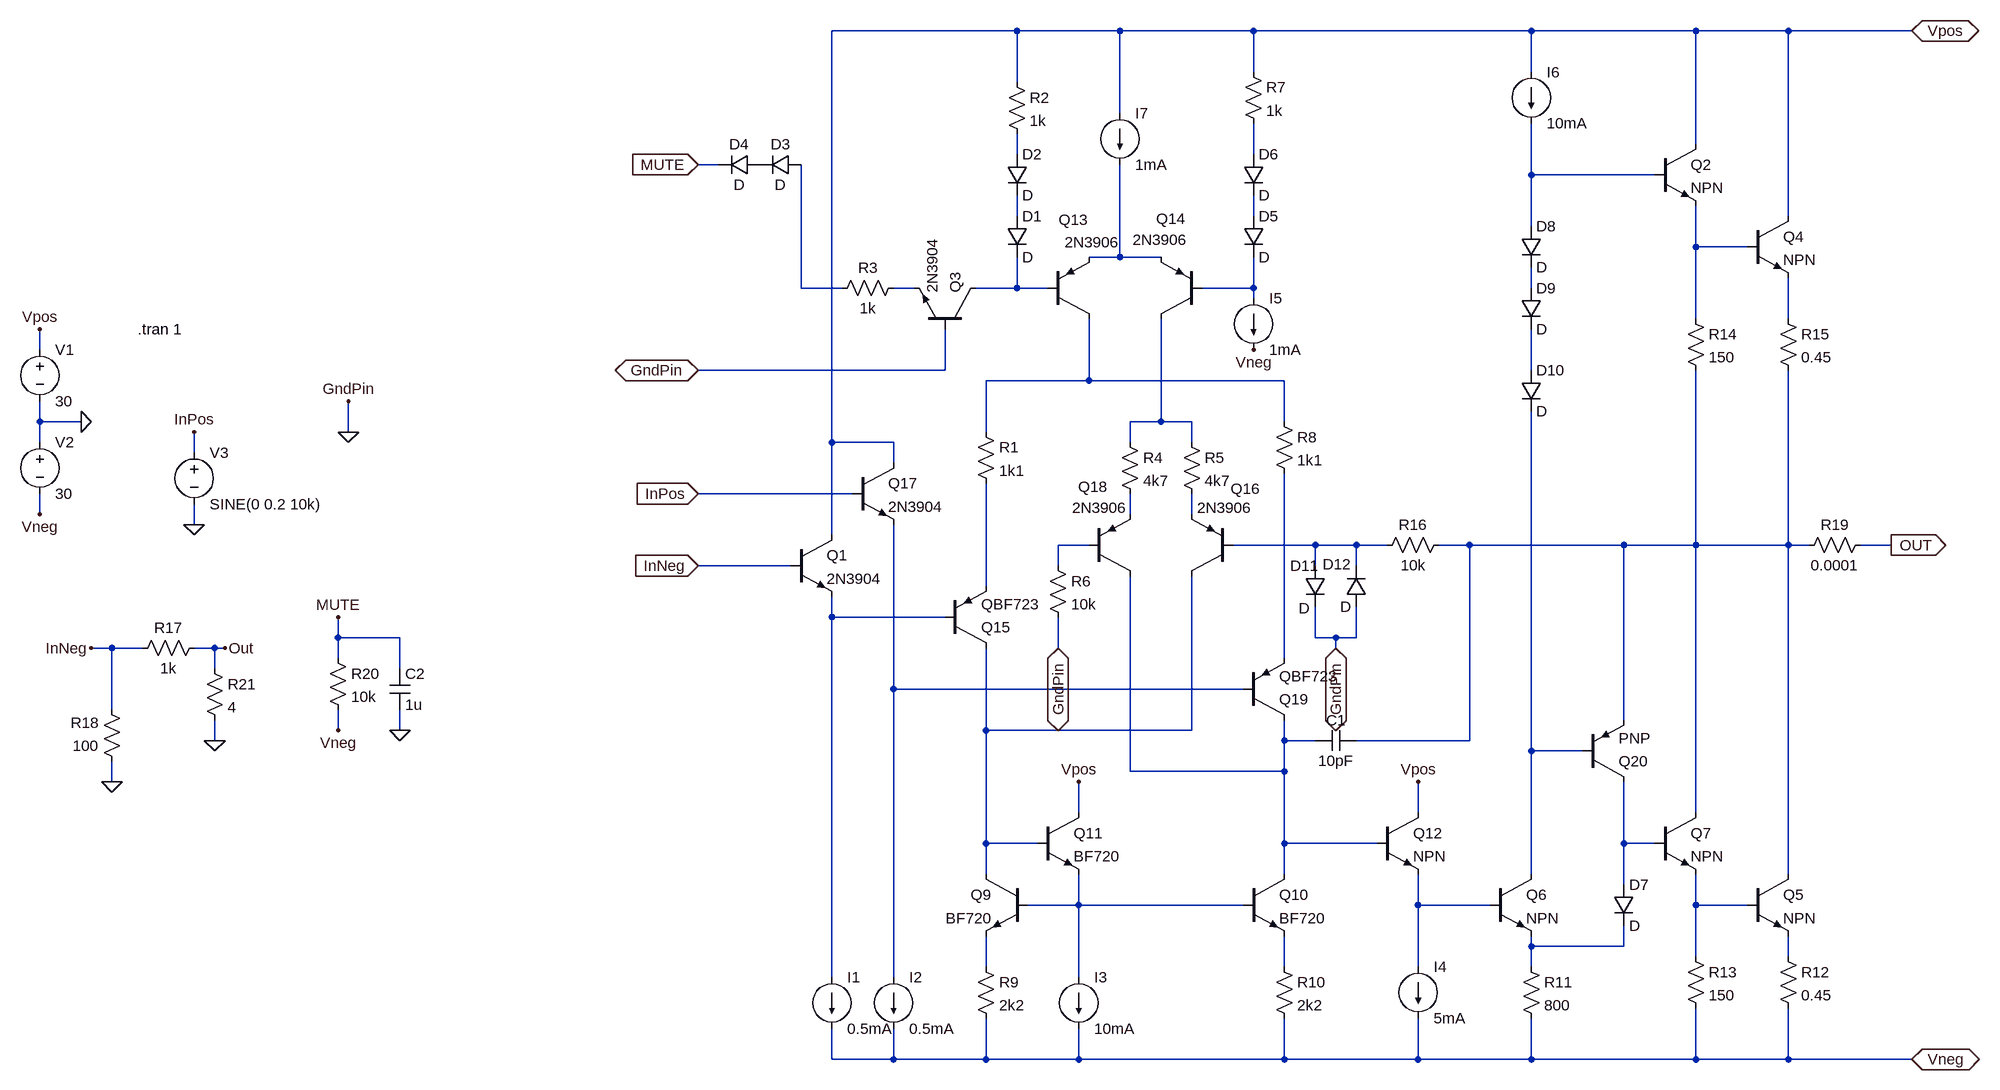
[diagram p0: schematic LM3886_MV2LT1363TRANSasc-1.asc]
LM3886_MV2LT1363TRANSasc-1.asc, the LTspice schematic file:
Version 4
SHEET 1 2284 1080
WIRE 144 -656 -144 -656
WIRE 304 -656 144 -656
WIRE 512 -656 304 -656
WIRE 944 -656 512 -656
WIRE 1200 -656 944 -656
WIRE 1344 -656 1200 -656
WIRE 1536 -656 1344 -656
WIRE 512 -592 512 -656
WIRE 944 -592 944 -656
WIRE 144 -576 144 -656
WIRE 304 -528 304 -656
WIRE 1200 -480 1200 -656
WIRE 144 -464 144 -496
WIRE 512 -464 512 -512
WIRE -320 -448 -352 -448
WIRE 944 -432 944 -512
WIRE 1136 -432 944 -432
WIRE 144 -368 144 -400
WIRE 512 -368 512 -400
WIRE 1344 -368 1344 -656
WIRE 944 -352 944 -432
WIRE 1200 -320 1200 -384
WIRE 1280 -320 1200 -320
WIRE 304 -304 304 -448
WIRE 304 -304 256 -304
WIRE 368 -304 304 -304
WIRE -192 -256 -192 -448
WIRE -128 -256 -192 -256
WIRE -16 -256 -48 -256
WIRE 144 -256 144 -304
WIRE 144 -256 80 -256
WIRE 192 -256 144 -256
WIRE 512 -256 512 -304
WIRE 512 -256 432 -256
WIRE 944 -256 944 -288
WIRE 512 -240 512 -256
WIRE 1200 -208 1200 -320
WIRE 1344 -208 1344 -272
WIRE -1376 -160 -1376 -192
WIRE 32 -128 32 -192
WIRE 32 -128 -352 -128
WIRE 944 -128 944 -192
WIRE 256 -112 256 -208
WIRE 256 -112 96 -112
WIRE 560 -112 256 -112
WIRE -1376 -48 -1376 -80
WIRE -1312 -48 -1376 -48
WIRE 368 -48 368 -208
WIRE 368 -48 320 -48
WIRE 416 -48 368 -48
WIRE 560 -48 560 -112
WIRE -896 -32 -896 -80
WIRE 96 -32 96 -112
WIRE -1376 -16 -1376 -48
WIRE -144 -16 -144 -656
WIRE -48 -16 -144 -16
WIRE 320 -16 320 -48
WIRE 416 -16 416 -48
WIRE -1136 0 -1136 -32
WIRE -48 16 -48 -16
WIRE -112 64 -352 64
WIRE -1376 96 -1376 64
WIRE 320 96 320 64
WIRE 416 96 416 64
WIRE -1136 112 -1136 80
WIRE -144 128 -144 -16
WIRE 256 144 208 144
WIRE 608 144 480 144
WIRE 672 144 608 144
WIRE 720 144 672 144
WIRE 848 144 800 144
WIRE 1088 144 848 144
WIRE 1200 144 1200 -128
WIRE 1200 144 1088 144
WIRE 1344 144 1344 -128
WIRE 1344 144 1200 144
WIRE 1376 144 1344 144
WIRE 1504 144 1456 144
WIRE -208 176 -352 176
WIRE 208 176 208 144
WIRE 608 176 608 144
WIRE 672 176 672 144
WIRE 96 208 96 48
WIRE -144 256 -144 224
WIRE 32 256 -144 256
WIRE -912 288 -912 256
WIRE -816 288 -912 288
WIRE 608 288 608 240
WIRE 640 288 608 288
WIRE 672 288 672 240
WIRE 672 288 640 288
WIRE -1264 304 -1296 304
WIRE -1216 304 -1264 304
WIRE -1104 304 -1136 304
WIRE -1088 304 -1104 304
WIRE 208 304 208 256
WIRE 640 304 640 288
WIRE -912 320 -912 288
WIRE 560 320 560 32
WIRE -1104 336 -1104 304
WIRE -816 336 -816 288
WIRE -48 368 -48 112
WIRE 496 368 -48 368
WIRE -1264 400 -1264 304
WIRE 1088 416 1088 144
WIRE -912 432 -912 400
WIRE -816 432 -816 400
WIRE 96 432 96 304
WIRE 416 432 416 192
WIRE 416 432 96 432
WIRE -1104 448 -1104 416
WIRE 560 448 560 416
WIRE 608 448 560 448
WIRE 848 448 848 144
WIRE 848 448 672 448
WIRE 944 464 944 -64
WIRE 1024 464 944 464
WIRE 320 496 320 192
WIRE 560 496 560 448
WIRE 560 496 320 496
WIRE -1264 512 -1264 480
WIRE 240 560 240 512
WIRE 768 560 768 512
WIRE 1200 560 1200 144
WIRE 96 608 96 432
WIRE 176 608 96 608
WIRE 560 608 560 496
WIRE 704 608 560 608
WIRE 1088 608 1088 512
WIRE 1136 608 1088 608
WIRE 96 656 96 608
WIRE 560 656 560 608
WIRE 944 656 944 464
WIRE 1344 656 1344 144
WIRE 1088 672 1088 608
WIRE 240 704 240 656
WIRE 240 704 160 704
WIRE 496 704 240 704
WIRE 768 704 768 656
WIRE 880 704 768 704
WIRE 1200 704 1200 656
WIRE 1280 704 1200 704
WIRE 944 768 944 752
WIRE 1088 768 1088 736
WIRE 1088 768 944 768
WIRE 1200 784 1200 704
WIRE 1344 784 1344 752
WIRE 96 800 96 752
WIRE 560 800 560 752
WIRE 768 800 768 704
WIRE 944 800 944 768
WIRE -144 816 -144 256
WIRE -48 816 -48 368
WIRE 240 816 240 704
WIRE -144 944 -144 896
WIRE -48 944 -48 896
WIRE -48 944 -144 944
WIRE 96 944 96 880
WIRE 96 944 -48 944
WIRE 240 944 240 896
WIRE 240 944 96 944
WIRE 560 944 560 880
WIRE 560 944 240 944
WIRE 768 944 768 880
WIRE 768 944 560 944
WIRE 944 944 944 880
WIRE 944 944 768 944
WIRE 1200 944 1200 864
WIRE 1200 944 944 944
WIRE 1344 944 1344 864
WIRE 1344 944 1200 944
WIRE 1536 944 1344 944
FLAG 240 512 Vpos
FLAG 768 512 Vpos
FLAG 512 -160 Vneg
FLAG -352 -448 MUTE
IOPIN -352 -448 In
FLAG -352 64 InPos
IOPIN -352 64 In
FLAG 1504 144 OUT
IOPIN 1504 144 Out
FLAG 1536 -656 Vpos
IOPIN 1536 -656 BiDir
FLAG 1536 944 Vneg
IOPIN 1536 944 BiDir
FLAG -352 176 InNeg
IOPIN -352 176 In
FLAG -352 -128 GndPin
IOPIN -352 -128 BiDir
FLAG 208 304 GndPin
IOPIN 208 304 BiDir
FLAG 640 304 GndPin
IOPIN 640 304 BiDir
FLAG -1312 -48 0
FLAG -1376 -192 Vpos
FLAG -1376 96 Vneg
FLAG -1136 112 0
FLAG -1136 -32 InPos
FLAG -1088 304 Out
FLAG -1264 512 0
FLAG -1296 304 InNeg
FLAG -816 432 0
FLAG -912 432 Vneg
FLAG -912 256 MUTE
FLAG -1104 448 0
FLAG -896 -80 GndPin
FLAG -896 -32 0
SYMBOL npn -208 128 R0
SYMATTR InstName Q1
SYMATTR Value 2N3904
SYMBOL npn 1136 -480 R0
SYMATTR InstName Q2
SYMBOL npn 80 -192 M270
SYMATTR InstName Q3
SYMATTR Value 2N3904
SYMBOL npn 1280 -368 R0
SYMATTR InstName Q4
SYMBOL npn 1280 656 R0
SYMATTR InstName Q5
SYMBOL npn 880 656 R0
SYMATTR InstName Q6
SYMBOL npn 1136 560 R0
SYMATTR InstName Q7
SYMBOL npn 160 656 M0
SYMATTR InstName Q9
SYMATTR Value BF720
SYMBOL npn 496 656 R0
SYMATTR InstName Q10
SYMATTR Value BF720
SYMBOL npn 176 560 R0
SYMATTR InstName Q11
SYMATTR Value BF720
SYMBOL npn 704 560 R0
SYMATTR InstName Q12
SYMBOL pnp 192 -208 M180
WINDOW 0 17 154 Left 0
WINDOW 3 26 119 Left 0
SYMATTR InstName Q13
SYMATTR Value 2N3906
SYMBOL pnp 432 -208 R180
WINDOW 0 26 156 Left 0
WINDOW 3 23 123 Left 0
SYMATTR InstName Q14
SYMATTR Value 2N3906
SYMBOL pnp 32 304 M180
SYMATTR InstName Q15
SYMATTR Value QBF723
SYMBOL pnp 480 192 R180
WINDOW 0 -42 136 Left 0
WINDOW 3 -29 106 Left 0
SYMATTR InstName Q16
SYMATTR Value 2N3906
SYMBOL pnp 256 192 M180
WINDOW 0 -17 139 Left 0
WINDOW 3 -26 106 Left 0
SYMATTR InstName Q18
SYMATTR Value 2N3906
SYMBOL res 80 -48 R0
SYMATTR InstName R1
SYMATTR Value 1k1
SYMBOL diode 128 -368 R0
SYMATTR InstName D1
SYMBOL diode 128 -464 R0
SYMATTR InstName D2
SYMBOL res 128 -592 R0
SYMATTR InstName R2
SYMATTR Value 1k
SYMBOL res -32 -272 R90
WINDOW 0 0 56 VBottom 0
WINDOW 3 32 56 VTop 0
SYMATTR InstName R3
SYMATTR Value 1k
SYMBOL diode -192 -464 R90
WINDOW 0 0 32 VBottom 0
WINDOW 3 32 32 VTop 0
SYMATTR InstName D3
SYMBOL diode -256 -464 R90
WINDOW 0 0 32 VBottom 0
WINDOW 3 32 32 VTop 0
SYMATTR InstName D4
SYMBOL res 304 -32 R0
SYMATTR InstName R4
SYMATTR Value 4k7
SYMBOL res 400 -32 R0
SYMATTR InstName R5
SYMATTR Value 4k7
SYMBOL res 192 160 R0
SYMATTR InstName R6
SYMATTR Value 10k
SYMBOL diode 496 -368 R0
SYMATTR InstName D5
SYMBOL diode 496 -464 R0
SYMATTR InstName D6
SYMBOL res 496 -608 R0
SYMATTR InstName R7
SYMATTR Value 1k
SYMBOL pnp 496 416 M180
SYMATTR InstName Q19
SYMATTR Value QBF723
SYMBOL res 544 -64 R0
SYMATTR InstName R8
SYMATTR Value 1k1
SYMBOL res 80 784 R0
SYMATTR InstName R9
SYMATTR Value 2k2
SYMBOL res 544 784 R0
SYMATTR InstName R10
SYMATTR Value 2k2
SYMBOL res 928 784 R0
SYMATTR InstName R11
SYMATTR Value 800
SYMBOL diode 1072 672 R0
SYMATTR InstName D7
SYMBOL res 1328 768 R0
SYMATTR InstName R12
SYMATTR Value 0.45
SYMBOL res 1184 768 R0
SYMATTR InstName R13
SYMATTR Value 150
SYMBOL res 1184 -224 R0
SYMATTR InstName R14
SYMATTR Value 150
SYMBOL res 1328 -224 R0
SYMATTR InstName R15
SYMATTR Value 0.45
SYMBOL diode 928 -352 R0
SYMATTR InstName D8
SYMBOL diode 928 -256 R0
SYMATTR InstName D9
SYMBOL diode 928 -128 R0
SYMATTR InstName D10
SYMBOL pnp 1024 512 M180
SYMATTR InstName Q20
SYMBOL res 816 128 R90
WINDOW 0 0 56 VBottom 0
WINDOW 3 32 56 VTop 0
SYMATTR InstName R16
SYMATTR Value 10k
SYMBOL cap 672 432 R90
WINDOW 0 0 32 VBottom 0
WINDOW 3 32 32 VTop 0
SYMATTR InstName C1
SYMATTR Value 10pF
SYMBOL diode 592 176 R0
WINDOW 0 -23 0 Left 0
WINDOW 3 -10 66 Left 0
SYMATTR InstName D11
SYMBOL diode 688 240 R180
WINDOW 0 24 66 Left 0
WINDOW 3 24 0 Left 0
SYMATTR InstName D12
SYMBOL current -144 816 R0
WINDOW 123 0 0 Left 0
WINDOW 39 0 0 Left 0
SYMATTR InstName I1
SYMATTR Value 0.5mA
SYMBOL current -48 816 R0
WINDOW 123 0 0 Left 0
WINDOW 39 0 0 Left 0
SYMATTR InstName I2
SYMATTR Value 0.5mA
SYMBOL current 240 816 R0
WINDOW 123 0 0 Left 0
WINDOW 39 0 0 Left 0
SYMATTR InstName I3
SYMATTR Value 10mA
SYMBOL current 768 800 R0
WINDOW 123 0 0 Left 0
WINDOW 39 0 0 Left 0
SYMATTR InstName I4
SYMATTR Value 5mA
SYMBOL current 512 -240 R0
WINDOW 123 0 0 Left 0
WINDOW 39 0 0 Left 0
SYMATTR InstName I5
SYMATTR Value 1mA
SYMBOL npn -112 16 R0
SYMATTR InstName Q17
SYMATTR Value 2N3904
SYMBOL current 944 -592 R0
WINDOW 123 0 0 Left 0
WINDOW 39 0 0 Left 0
SYMATTR InstName I6
SYMATTR Value 10mA
SYMBOL current 304 -528 R0
WINDOW 123 0 0 Left 0
WINDOW 39 0 0 Left 0
SYMATTR InstName I7
SYMATTR Value 1mA
SYMBOL res 1472 128 R90
WINDOW 0 0 56 VBottom 0
WINDOW 3 32 56 VTop 0
SYMATTR InstName R19
SYMATTR Value 0.0001
SYMBOL voltage -1376 -176 R0
WINDOW 123 0 0 Left 0
WINDOW 39 0 0 Left 0
SYMATTR InstName V1
SYMATTR Value 30
SYMBOL voltage -1376 -32 R0
WINDOW 123 0 0 Left 0
WINDOW 39 0 0 Left 0
SYMATTR InstName V2
SYMATTR Value 30
SYMBOL voltage -1136 -16 R0
WINDOW 123 0 0 Left 0
WINDOW 39 0 0 Left 0
SYMATTR InstName V3
SYMATTR Value SINE(0 0.2 10k)
SYMBOL res -1120 288 R90
WINDOW 0 0 56 VBottom 0
WINDOW 3 32 56 VTop 0
SYMATTR InstName R17
SYMATTR Value 1k
SYMBOL res -1248 496 R180
WINDOW 0 36 76 Left 0
WINDOW 3 36 40 Left 0
SYMATTR InstName R18
SYMATTR Value 100
SYMBOL res -928 304 R0
SYMATTR InstName R20
SYMATTR Value 10k
SYMBOL cap -832 336 R0
SYMATTR InstName C2
SYMATTR Value 1u
SYMBOL res -1120 320 R0
SYMATTR InstName R21
SYMATTR Value 4
TEXT -1224 -192 Left 0 !.tran 1

The netlist it stands for:
* LM3886_MV2LT1363TRANSasc-1.asc
Q1 Vpos InNeg N023 0 2N3904
Q2 Vpos N003 N006 0 NPN
Q3 N010 0 N009 0 2N3904
Q4 Vpos N006 N013 0 NPN
Q5 N021 N032 N034 0 NPN
Q6 N028 N031 N033 0 NPN
Q7 N021 N029 N032 0 NPN
Q9 N026 N030 N035 0 BF720
Q10 N027 N030 N036 0 BF720
Q11 Vpos N026 N030 0 BF720
Q12 Vpos N027 N031 0 NPN
Q13 N015 N010 N007 0 2N3906
Q14 N016 N011 N007 0 2N3906
Q15 N026 N023 N022 0 QBF723
Q16 N026 N020 N018 0 2N3906
Q18 N027 N019 N017 0 2N3906
R1 N015 N022 1k1
D1 N004 N010 D
D2 N001 N004 D
R2 Vpos N001 1k
R3 N009 N008 1k
D3 N008 P001 D
D4 P001 MUTE D
R4 N016 N017 4k7
R5 N016 N018 4k7
R6 N019 0 10k
D5 N005 N011 D
D6 N002 N005 D
R7 Vpos N002 1k
Q19 N027 N025 N024 0 QBF723
R8 N015 N024 1k1
R9 N035 Vneg 2k2
R10 N036 Vneg 2k2
R11 N033 Vneg 800
D7 N029 N033 D
R12 N034 Vneg 0.45
R13 N032 Vneg 150
R14 N006 N021 150
R15 N013 N021 0.45
D8 N003 N012 D
D9 N012 N014 D
D10 N014 N028 D
Q20 N029 N028 N021 0 PNP
R16 N021 N020 10k
C1 N021 N027 10pF
D11 N020 0 D
D12 0 N020 D
I1 N023 Vneg 0.5mA
I2 N025 Vneg 0.5mA
I3 N030 Vneg 10mA
I4 N031 Vneg 5mA
I5 N011 Vneg 1mA
Q17 Vpos InPos N025 0 2N3904
I6 Vpos N003 10mA
I7 Vpos N007 1mA
R19 OUT N021 0.0001
V1 Vpos 0 30
V2 0 Vneg 30
V3 InPos 0 SINE(0 0.2 10k)
R17 OUT InNeg 1k
R18 0 InNeg 100
R20 MUTE Vneg 10k
C2 MUTE 0 1u
R21 OUT 0 4
.model D D
.lib standard.dio
.model NPN NPN
.model PNP PNP
.lib standard.bjt
.tran 1
.backanno
.end